# Altium schematic sheet MCU.SchDoc
size A4; SheetNumber: 8; SheetTotal: 8
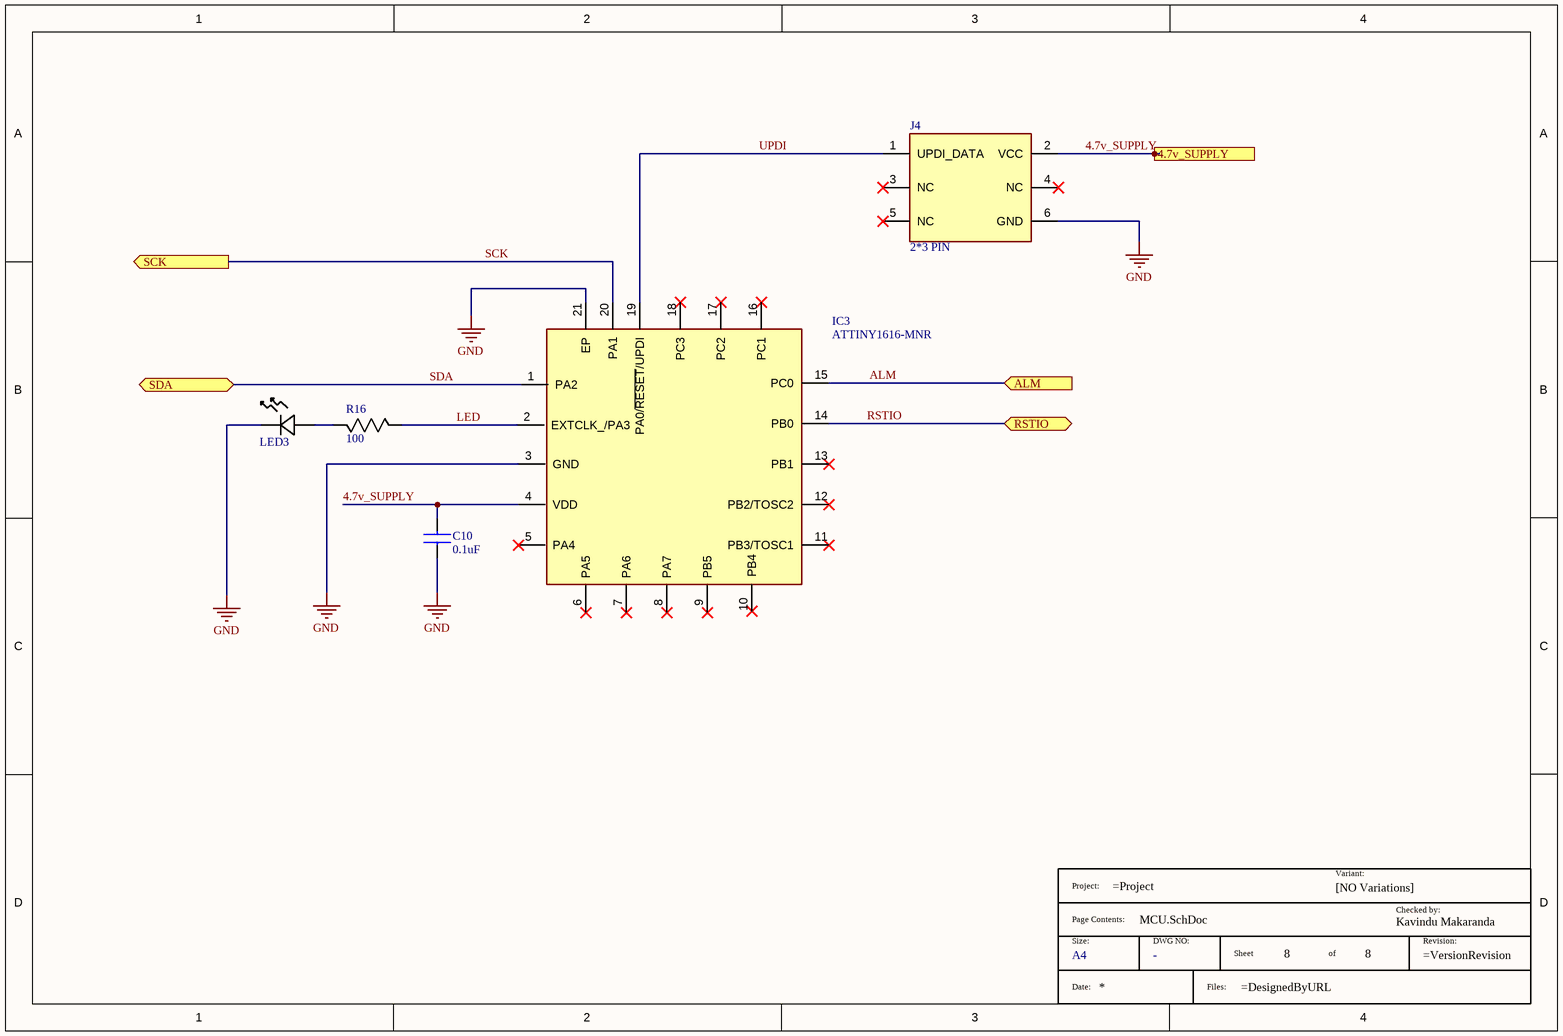
[diagram p0: MCU.SchDoc]

## Parts
*?  Size: A4  (hidden comment: TitleBlock)  (graphical)
C10  0.1uF  [C0603]
IC3  ATTINY1616-MNR  [QFN40P300X300X90-21N]
J4  2*3 PIN  [HDRV6W64P254_2X3_762X508X868P]
LED3  LED GREEN DIFFUSED 0603 SMD  [LED_B1931NG_HVK]  (value not drawn)
R16  100  [RESC1608X55N]

## Ports
4.7v_SUPPLY (in, see Main_sch[2B], DISPLAY[2C], FUEL GAUGE IC[1B], VOLTAGE REGULATOR[3B]), ALM (in, see Main_sch[3B], FUEL GAUGE IC[1B]), RSTIO (bidir, see Main_sch[3B], FUEL GAUGE IC[1C]), SCK (out, see Main_sch[3C], DISPLAY[2B], FUEL GAUGE IC[1B]), SDA (bidir, see Main_sch[3C], DISPLAY[2B], FUEL GAUGE IC[1B])

## Nets
GND: C10.1 IC3.3(GND) IC3.21(EP) J4.6(GND) LED3.1(CATHODE)
4.7v_SUPPLY: C10.2 IC3.4(VDD) J4.2(VCC) ; port 4.7v_SUPPLY
ALM: IC3.15(PC0) ; port ALM
LED: IC3.2(EXTCLK_/PA3) R16.1
RSTIO: IC3.14(PB0) ; port RSTIO
SCK: IC3.20(PA1) ; port SCK
SDA: IC3.1(PA2) ; port SDA
UPDI: IC3.19(PA0/~{RESET}/UPDI) J4.1(UPDI_DATA)
NetLED3_2: LED3.2(ANODE) R16.2

Not connected (* = marked no-connect by the designer): IC3 5(PA4)* 6(PA5)* 7(PA6)* 8(PA7)* 9(PB5)* 10(PB4)* 11(PB3/TOSC1)* 12(PB2/TOSC2)* 13(PB1)* 16(PC1)* 17(PC2)* 18(PC3)*; J4 3(NC)* 4(NC)* 5(NC)*

## Notes on the sheet
- THIS DOCUMENT AND THE DATA DISCLOSED HEREIN OR
- HEREWITH IS THE PROPERTY OF ALTIUM LIMITED AND MAY
- DWG NO:
- REVISION
- REV:
- DESCRIPTION
- DATE
- APPROVED
- BE FREELY DISTRIBUTED IN WHOLE. NO RIGHTS ARE
- RESERVED OR EXPRESS OR IMPLIED WARANTEE GIVEN.
- ENG:
- APPROVALS
- PROJECT
- DSN:
- CHK:
- REFERENCE DOCUMENTS
- PROJECT REVISION:
- TITLE
- DOCUMENT REVISION:
- DESIGN ITEM:
- BOM:
- FAB DWG:
- PCB DWG:
- ASSY DWG:
- SCALE:
- A3
- SIZE
- CAGE CODE
- FILE NAME
- DWG NO.
- SHEET
- OF
- REV
- (in symbol TitleBlock) Project:; Variant:; [NO Variations]; Checked by:; Page Contents:; Kavindu Makaranda; Size:; DWG NO:; Sheet; of; Revision:; Date:; Files:

## Library data of the parts
*? = TitleBlock: Standard Title Block; DWG NO: -
C10 = C0603C104K3RACTU: Capacitor C0603C104K3RACTU; Manufacturer_Name: KEMET; Datasheet Link: https://content.kemet.com/datasheets/KEM_C1002_X7R_SMD.pdf; Height: 0.87mm; Manufacturer_Part_Number: C0603C104K3RACTU; Mouser Part Number: 80-C0603C104K3R; Mouser Price/Stock: https://www.mouser.co.uk/ProductDetail/KEMET/C0603C104K3RACTU?qs=l5k%252BbMnNDklvfdneglCDAg%3D%3D; Arrow Part Number: C0603C104K3RACTU; Arrow Price/Stock: https://www.arrow.com/en/products/c0603c104k3ractu/kemet-corporation?utm_currency=USD&region=nac; Supplier 1: Arrow Electronics; Supplier Part Number 1: C0603C104K3RACTU
IC3 = ATTINY1616-MNR: Integrated Circuit ATTINY1616-MNR; Manufacturer_Name: Microchip; Datasheet Link: https://datasheet.datasheetarchive.com/originals/distributors/DKDS41/DSANUWW0026757.pdf; Height: 0.9mm; Manufacturer_Part_Number: ATTINY1616-MNR; Mouser Part Number: 556-ATTINY1616MNR; Mouser Price/Stock: https://www.mouser.co.uk/ProductDetail/Microchip-Technology/ATTINY1616-MNR?qs=HXFqYaX1Q2yKNpuKQU9qww%3D%3D; Arrow Part Number: ATTINY1616-MNR; Arrow Price/Stock: https://www.arrow.com/en/products/attiny1616-mnr/microchip-technology?utm_currency=USD&region=nac; Supplier 1: Digikey; Supplier Part Number 1: ATTINY1616-MNRCT-ND
J4 = M20-9980346: Connector; Manufacturer_Name: Harwin; Datasheet Link: https://cdn.harwin.com/pdfs/M20-998.pdf; Height: 8.68mm; Manufacturer_Part_Number: M20-9980346; Mouser Part Number: 855-M20-9980346; Mouser Price/Stock: https://www.mouser.co.uk/ProductDetail/Harwin/M20-9980346?qs=%252Bk6%2F5FB6qrmHk2P20oz3FA%3D%3D; Supplier 1: Digikey; Supplier Part Number 1: 952-2121-ND
LED3 = B1931NG--20D001114U1930: Mfr_Name: Harvatek; Type: LED Indication; Supplier 1: Digikey; Supplier Part Number 1: 3147-B1931NG--20D001114U1930CT-ND
R16 = ERJ-3EKF1000V: Resistor ERJ-3EKF1000V; Manufacturer_Name: Panasonic; Datasheet Link: http://industrial.panasonic.com/cdbs/www-data/pdf/RDA0000/AOA0000C86.pdf; Height: 0.55mm; Manufacturer_Part_Number: ERJ-3EKF1000V; Mouser Part Number: 667-ERJ-3EKF1000V; Mouser Price/Stock: https://www.mouser.co.uk/ProductDetail/Panasonic/ERJ-3EKF1000V?qs=H7k1u0Mp9JS7i8KGO5m47A%3D%3D; Arrow Part Number: ERJ-3EKF1000V; Arrow Price/Stock: https://www.arrow.com/en/products/erj-3ekf1000v/panasonic?utm_currency=USD&region=nac; Supplier 1: Mouser; Supplier Part Number 1: 667-ERJ-3EKF1000V